# Altium schematic sheet EM8500.SchDoc
size A3; SheetNumber: 5; SheetTotal: 8
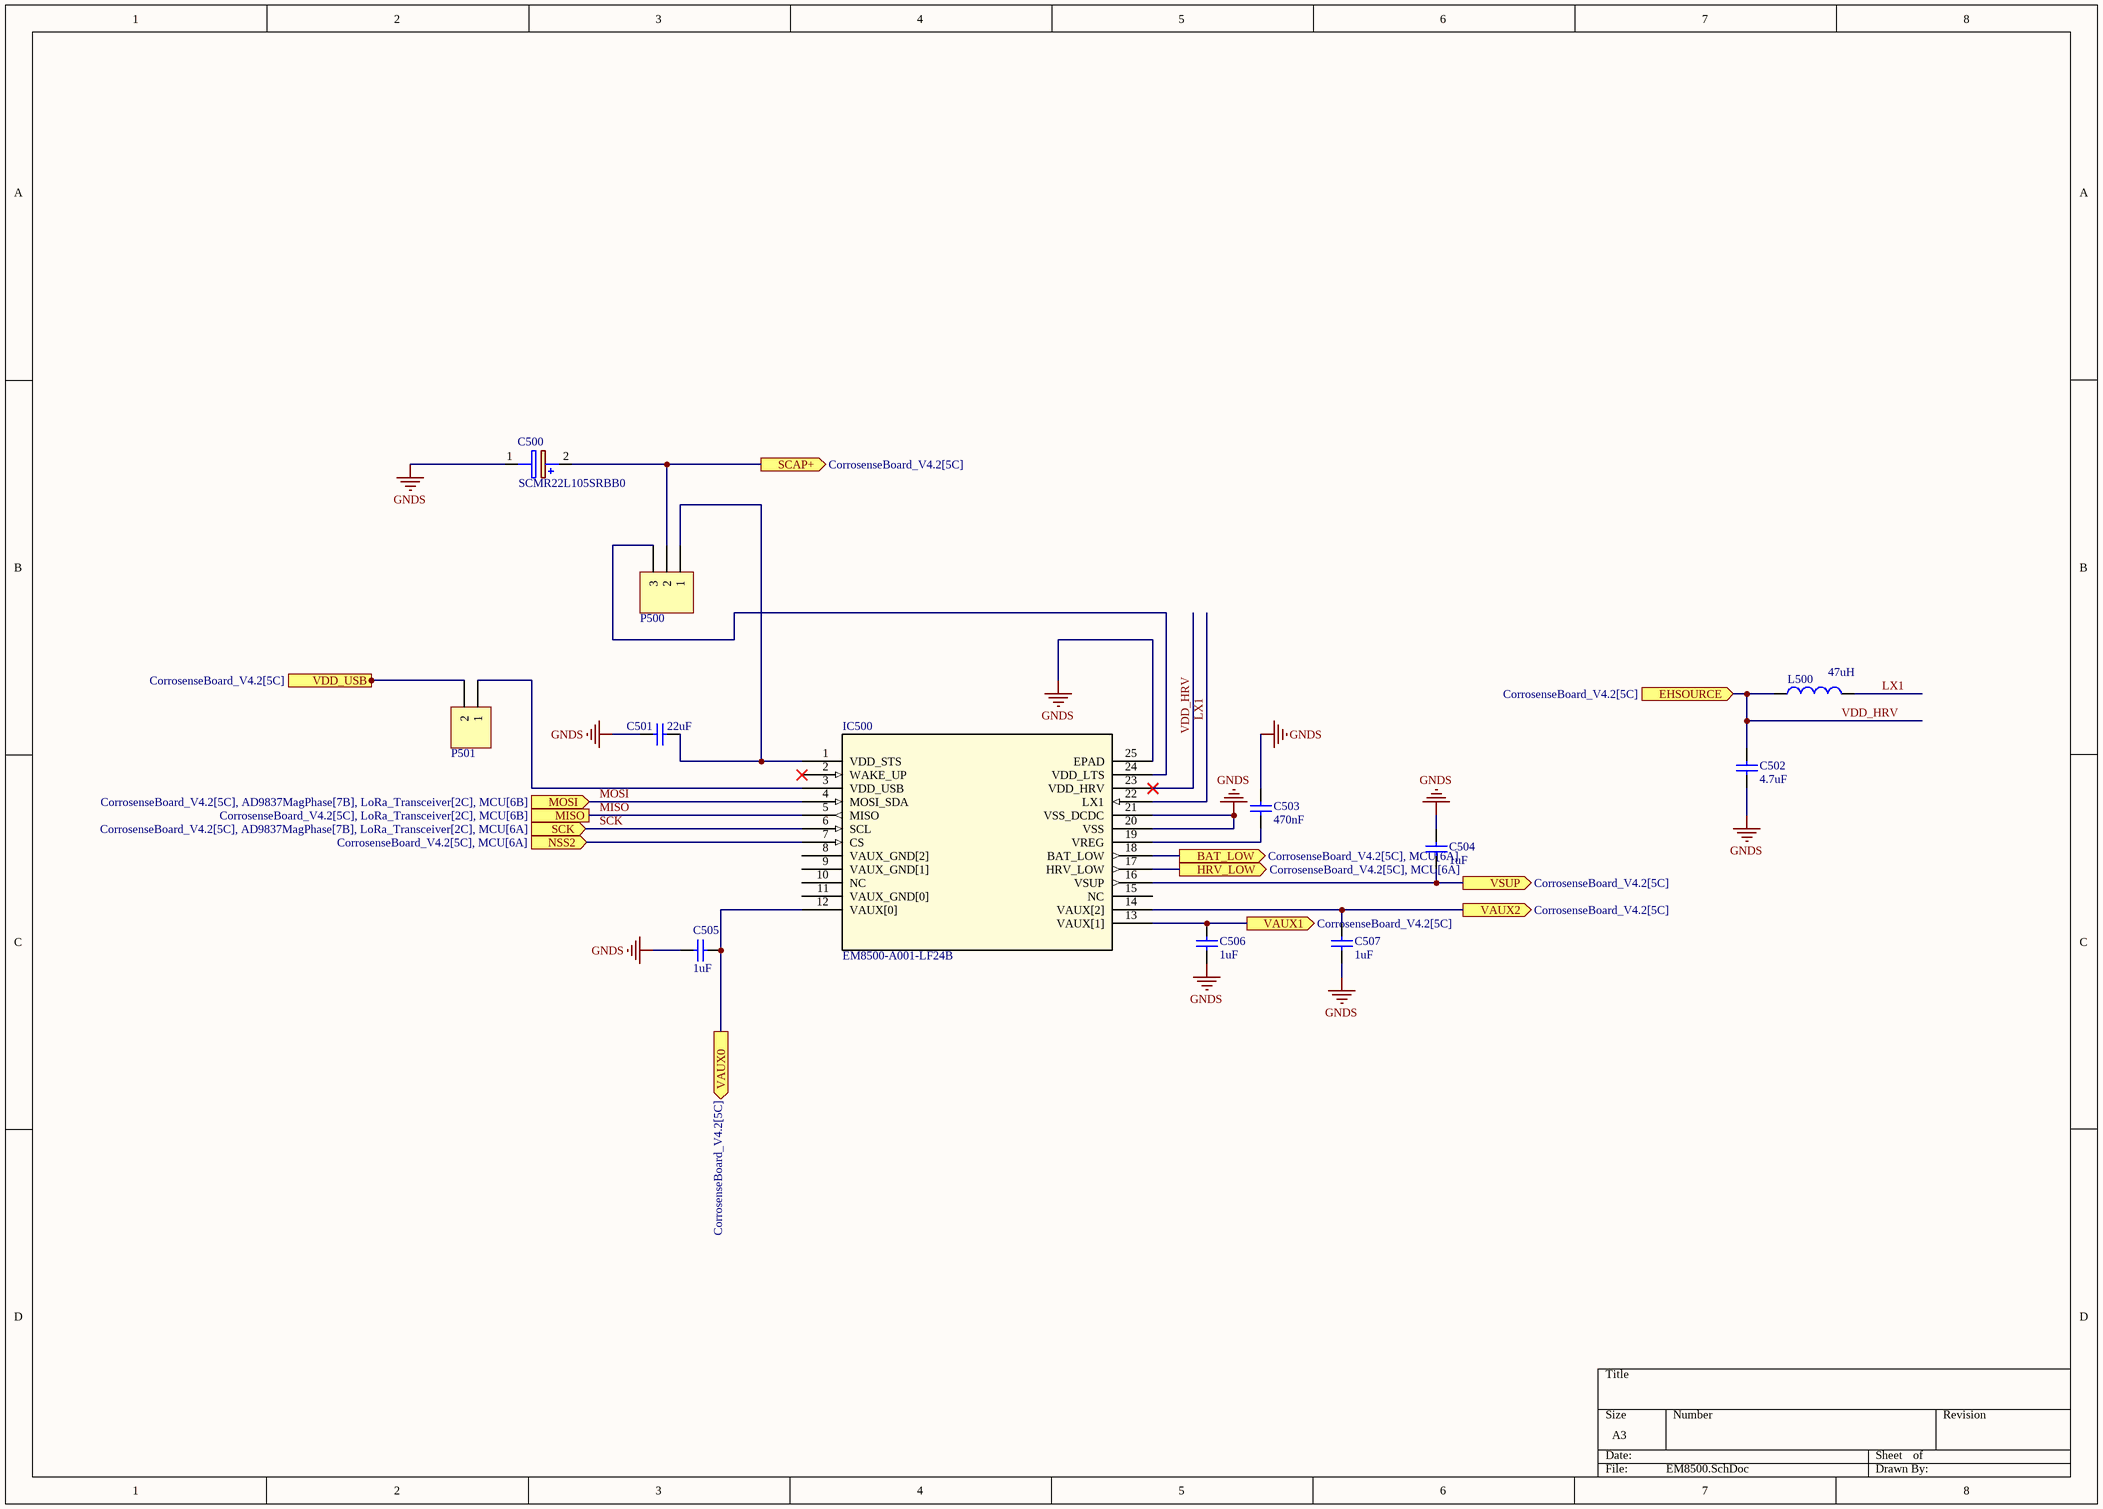
[diagram p0: EM8500.SchDoc]

## Parts
C500  SCMR22L105SRBB0  [SCMR22L105SRBB0]
C501  22uF  [1608[0603]]
C502  4.7uF  [1608[0603]]
C503  470nF  [1608[0603]]
C504  1uF  [1608[0603]]
C505  1uF  [1608[0603]]
C506  1uF  [1608[0603]]
C507  1uF  [1608[0603]]
IC500  EM8500-A001-LF24B  [QFN24_4X4_MAR]
L500  47uH  [C0805]
P500  Header, 3-Pin  [HDR1X3]  (value not drawn)
P501  Header, 2-Pin  [HDR1X2]  (value not drawn)

## Ports
BAT_LOW (out, see CorrosenseBoard_V4.2[5C], MCU[6A]), EHSOURCE (in, see CorrosenseBoard_V4.2[5C]), HRV_LOW (out, see CorrosenseBoard_V4.2[5C], MCU[6A]), MISO (see CorrosenseBoard_V4.2[5C], LoRa_Transceiver[2C], MCU[6B]), MOSI (in, see CorrosenseBoard_V4.2[5C], AD9837MagPhase[7B], LoRa_Transceiver[2C], MCU[6B]), NSS2 (in, see CorrosenseBoard_V4.2[5C], MCU[6A]), SCAP+ (out, see CorrosenseBoard_V4.2[5C]), SCK (in, see CorrosenseBoard_V4.2[5C], AD9837MagPhase[7B], LoRa_Transceiver[2C], MCU[6A]), VAUX0 (out, see CorrosenseBoard_V4.2[5C]), VAUX1 (out, see CorrosenseBoard_V4.2[5C]), VAUX2 (out, see CorrosenseBoard_V4.2[5C]), VDD_USB (in, see CorrosenseBoard_V4.2[5C]), VSUP (out, see CorrosenseBoard_V4.2[5C])

## Nets
GNDS: C500.1(-) C501.1 C502.1 C503.1 C504.2 C505.1 C506.1 C507.1 IC500.20(VSS) IC500.21(VSS_DCDC) IC500.25(EPAD)
BAT_LOW: IC500.18(BAT_LOW) ; port BAT_LOW
HRV_LOW: IC500.17(HRV_LOW) ; port HRV_LOW
LX1: IC500.22(LX1) L500.2
MISO: IC500.5(MISO) ; port MISO
MOSI: IC500.4(MOSI_SDA) ; port MOSI
NSS2: IC500.7(CS) ; port NSS2
SCAP+: C500.2(+) P500.2 ; port SCAP+
SCK: IC500.6(SCL) ; port SCK
VAUX0: C505.2 IC500.12(VAUX[0]) ; port VAUX0
VAUX1: C506.2 IC500.13(VAUX[1]) ; port VAUX1
VAUX2: C507.2 IC500.14(VAUX[2]) ; port VAUX2
VDD_HRV: C502.2 IC500.23(VDD_HRV) L500.1 ; port EHSOURCE
VDD_USB: P501.2 ; port VDD_USB
VSUP: C504.1 IC500.16(VSUP) ; port VSUP
NetC501_2: C501.2 IC500.1(VDD_STS) P500.1
NetC503_2: C503.2 IC500.19(VREG)
NetIC500_3: IC500.3(VDD_USB) P501.1
NetIC500_24: IC500.24(VDD_LTS) P500.3

Not connected (* = marked no-connect by the designer): IC500 2(WAKE_UP)* 8(VAUX_GND[2]) 9(VAUX_GND[1]) 10(NC) 11(VAUX_GND[0]) 15(NC)

## Library data of the parts
C500 = SCMR22L105SRBB0: Capacitor Polarised; Manufacturer_Name: Kyocera AVX; Temperature Coefficient: X7R; Tolerance: ±10%; Voltage - Rated: 25V; Datasheet Link: https://datasheet.datasheetarchive.com/originals/distributors/Datasheets_SAMA/1acd652de717f0406628b513d6ceaee9.pdf; Height: 22mm; Manufacturer_Part_Number: SCMR22L105SRBB0; Mouser Part Number: 581-SCMR22L105SRBB0; Mouser Price/Stock: https://www.mouser.co.uk/ProductDetail/AVX/SCMR22L105SRBB0?qs=qSfuJ%252Bfl%2Fd5S4%2FZjZ0mbDA%3D%3D; Arrow Part Number: SCMR22L105SRBB0; Arrow Price/Stock: https://www.arrow.com/en/products/scmr22l105srbb0/avx; Operating Temperature: -55°C ~ 125°C; Package / Case: 0603 (1608 Metric); Manufacturer: Kyocera AVX; MPN: SCMR22L105SRBB0
C501 = Cap: CAP CER 25V X7R 0603; Manufacturer: Murata Electronics; MPN: GRM188C61E226ME01J; Tolerance: ±10%; Value: 22uF; Operating Temperature: -55°C ~ 125°C; Package / Case: 0603 (1608 Metric); Temperature Coefficient: X7R; Voltage - Rated: 25V
C502 = Cap: CAP CER 25V X7R 0603; Manufacturer: Murata Electronics; MPN: GRM188R61E475KE11J; Tolerance: ±10%; Value: 4.7uF; Operating Temperature: -55°C ~ 125°C; Package / Case: 0603 (1608 Metric); Temperature Coefficient: X7R; Voltage - Rated: 25V
C503 = Cap: CAP CER 25V X7R 0603; Manufacturer: Murata Electronics; MPN: GCM188R71E474KA64D; Tolerance: ±10%; Value: 470nF; Operating Temperature: -55°C ~ 125°C; Package / Case: 0603 (1608 Metric); Temperature Coefficient: X7R; Voltage - Rated: 25V
C504-C507 = Cap: CAP CER 25V X7R 0603; Manufacturer: Murata Electronics; MPN: GCM188R71E105KA64D; Tolerance: ±10%; Value: 1uF; Operating Temperature: -55°C ~ 125°C; Package / Case: 0603 (1608 Metric); Temperature Coefficient: X7R; Voltage - Rated: 25V
IC500 = EM8500-A001-LF24B: No Description Available; Mfr_Name: EM Microelectronic-Marin; MPN: EM8500-A001-LF24B+; Digi-Key_Part_Number_3: 2651-EM8500-A001-LF24B+DKR-ND; Digi-Key_Part_Number_2: 2651-EM8500-A001-LF24B+CT-ND; Digi-Key_Part_Number_1: 2651-EM8500-A001-LF24B+TR-ND; RefDes: RefDes; Type: Type; Manufacturer: EM Microelectronic-Marin
L500 = Inductor: Manufacturer: TAIYO YUDEN; MPN: BRL2012T470M; Code_IEC: 1005; Published: 8-Jun-2000; Publisher: Altium Limited; Code_JEITA: 0402; Value: 47uH
P500 = Header 3: Manufacturer: Wurth Elektronik; MPN: 61300311121; Publisher: Altium Limited
P501 = Header 2: Manufacturer: Wurth Elektronik; MPN: 61300211121; Publisher: Altium Limited